# Altium schematic sheet 0.ESP32_WROOM.SchDoc
size A4; PageSetup: Record=PageOptions|CenterHorizontal=True|CenterVertical=True|PrintScale=0.50|XCorrection=1.00|YCorrection=1.00|PrintKind=1|BorderSize=5000000|LeftOffset=0|BottomOffset=0|Orientation=2|PaperLength=1000|PaperWidth=1000|Scale=100|PaperSource=7|PrintQuality=-4|MediaType=1|DitherType=10|PaperKind=A4|PrintScaleMode=1
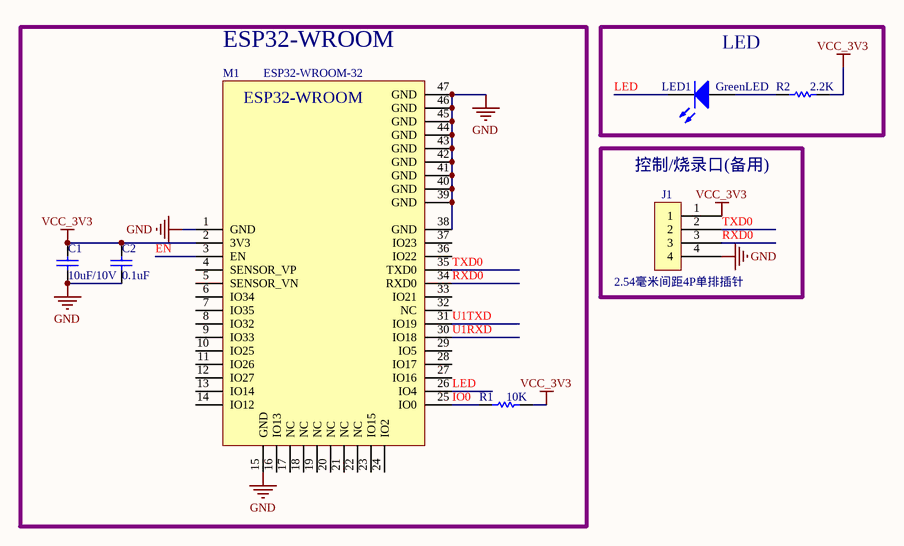
[diagram p0: 0.ESP32_WROOM.SchDoc]

## Parts
C1  10uF/10V  [0402]
C2  0.1uF  [0402]
J1  2.54毫米间距4P单排插针  [SIP4_2.54mm]
LED1  GreenLED  [LED0402]
M1  ESP32-WROOM-32  [ESP32_WROOM-32]
R1  10K  [0402]
R2  2.2K  [0402]

## Blocks framed on the sheet
ESP32-WROOM: C1 C2 M1 R1
LED: LED1 R2
控制/烧录口(备用): J1

## Nets
GND: C1.1 C2.1 J1.4 M1.1(GND) M1.15(GND) M1.38(GND) M1.39(GND) M1.40(GND) M1.41(GND) M1.42(GND) M1.43(GND) M1.44(GND) M1.45(GND) M1.46(GND) M1.47(GND)
VCC_3V3: C1.2 C2.2 J1.1 M1.2(3V3) R1.2 R2.2
EN: M1.3(EN)
IO0: M1.25(IO0) R1.1
LED: LED1.2(K) M1.26(IO4)
RXD0: J1.3 M1.34(RXD0)
TXD0: J1.2 M1.35(TXD0)
U1RXD: M1.30(IO18)
U1TXD: M1.31(IO19)
NetLED1_1: LED1.1(A) R2.1

Not connected (* = marked no-connect by the designer): M1 4(SENSOR_VP) 5(SENSOR_VN) 6(IO34) 7(IO35) 8(IO32) 9(IO33) 10(IO25) 11(IO26) 12(IO27) 13(IO14) 14(IO12) 16(IO13) 17(NC) 18(NC) 19(NC) 20(NC) 21(NC) 22(NC) 23(IO15) 24(IO2) 27(IO16) 28(IO17) 29(IO5) 32(NC) 33(IO21) 36(IO22) 37(IO23)

## Notes on the sheet
- (in symbol ESP32-WROOM-32) ESP32-WROOM

## Library data of the parts
C1 C2 = Cap: Capacitor; PartNumber: CAP100NF; Published: 8-Jun-2000; LatestRevisionDate: 17-Jul-2002; LatestRevisionNote: Re-released for DXP Platform.; PackageReference: 0402; Publisher: Altium Limited
  C1: Value: 10uF/10V
  C2: Value: 0.1uF
J1 = SIP4_MIRROR: Value: 2.54毫米间距4P单排插针
LED1 = LED2: Typical RED, GREEN, YELLOW, AMBER GaAs LED; Published: 8-Jun-2000; LatestRevisionDate: 17-Jul-2002; LatestRevisionNote: Re-released for DXP Platform.; PackageVersion: Feb-2002; PackageReference: 3.2X1.6X1.1; Publisher: Altium Limited; PackageDescription: SM LED; 2 Flat Leads; Value: GreenLED
R1 R2 = Res1: Resistor; PartNumber: RES2.2K; Published: 8-Jun-2000; LatestRevisionDate: 17-Jul-2002; LatestRevisionNote: Re-released for DXP Platform.; PackageReference: 0402; Publisher: Altium Limited
  R1: Value: 10K
  R2: Value: 2.2K